# Altium schematic sheet GoPros.SchDoc
size A
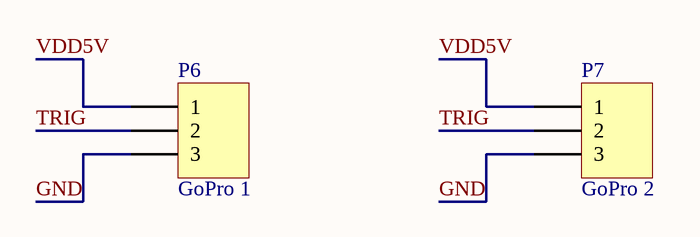
[diagram p0: GoPros.SchDoc]

## Parts
P6  GoPro 1  [HDR1X3]
P7  GoPro 2  [HDR1X3]

## Nets
GND: P6.3 P7.3
TRIG: P6.2 P7.2
VDD5V: P6.1 P7.1

## Library data of the parts
P6 P7 = Header 3: Header, 3-Pin; LatestRevisionDate: 17-Jul-2002; LatestRevisionNote: Re-released for DXP Platform.; Publisher: Altium Limited